# EAGLE schematic eeZee_tiny (EAGLE 6.3)
DATABASE: ./../../../EAGLE/PARTSDB.TXT
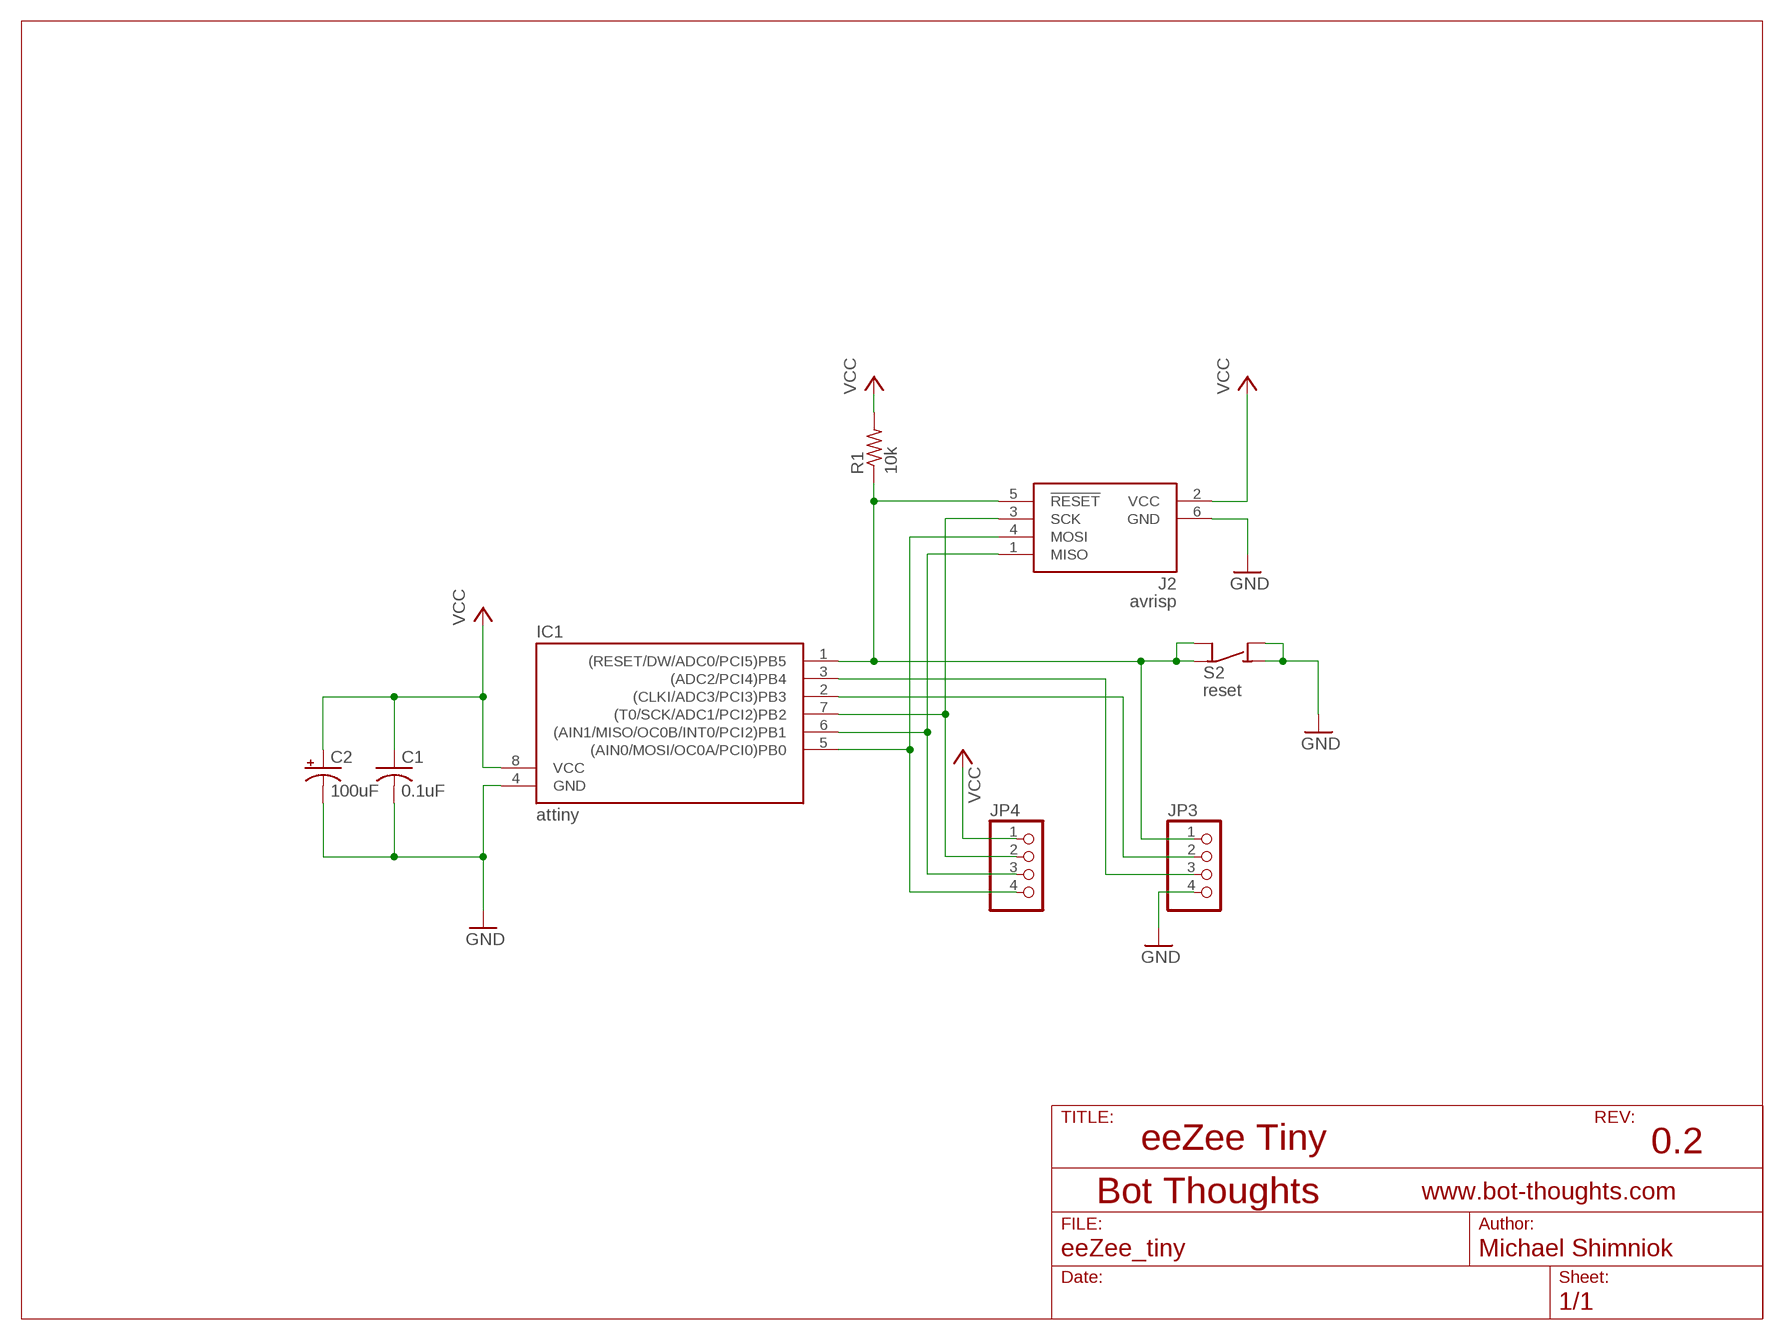
[diagram p0: schematic, sheet 1]

## Parts
C1  0.1uF  C-USC0603  [C0603]
C2  100uF  CPOL-USSMCB  [SMC_B]
IC1  attiny  ATTINY13-20P  [DIL08]
J2  avrisp  AVRISP6  [CON6P2R]
JP3  PINHD-1X04_2.54-S  [1X04-S]
JP4  PINHD-1X04_2.54-S  [1X04-S]
R1  10k  R-US_R0603  [R0603]
S2  reset  SPST4  [6MMTACTILE_4PIN]

## Nets
!RESET: IC1.1((RESET/DW/ADC0/PCI5)PB5) J2.5(!RESET) JP3.1 R1.1 S2.B1(COM) S2.B2(COM)
GND: C1.2 C2.- IC1.4(GND) J2.6(GND) JP3.4 S2.A1(NO) S2.A2(NO)
MISO: IC1.6((AIN1/MISO/OC0B/INT0/PCI2)PB1) J2.1(MISO) JP4.3
MOSI: IC1.5((AIN0/MOSI/OC0A/PCI0)PB0) J2.4(MOSI) JP4.4
N$2: IC1.2((CLKI/ADC3/PCI3)PB3) JP3.2
N$8: IC1.3((ADC2/PCI4)PB4) JP3.3
SCK: IC1.7((T0/SCK/ADC1/PCI2)PB2) J2.3(SCK) JP4.2
VCC: C1.1 C2.+ IC1.8(VCC) J2.2(VCC) JP4.1 R1.2

## Notes on the sheet
- eeZee Tiny | 0.2

## Library data of the parts
C1 = rcl:C-US: CAPACITOR, American symbol; BOM: EXCLUDE; PARTNO: 0603YC104KAT2A
C2 = rcl:CPOL-US: POLARIZED CAPACITOR, American symbol; BOM: INCLUDE; PARTNO: F930J107MBA
IC1 = avr:ATTINY13: MICROCONTROLLER 1 Kbytes FLASH 64 bytes EEPROM 64 bytes RAM 4-channel 10 bit ADC; PARTNO: A08-LC-TT-R
J2 = ads4:AVRISP6: 6-pin dual-row connector for Atmel AVRISP programmer interface
JP3 JP4 = pinhead-2:PINHD-1X04: PIN HEADER
R1 = rcl:R-US_: RESISTOR, American symbol; PARTNO: ERJ-3GEYJ103V
S2 = mes_electromech:SPST4: SPST switch with 2 pins per contact